# EAGLE design EAGLE_PCB_Design_Project1.3_DavidSalzmann (EAGLE 9.6.2)
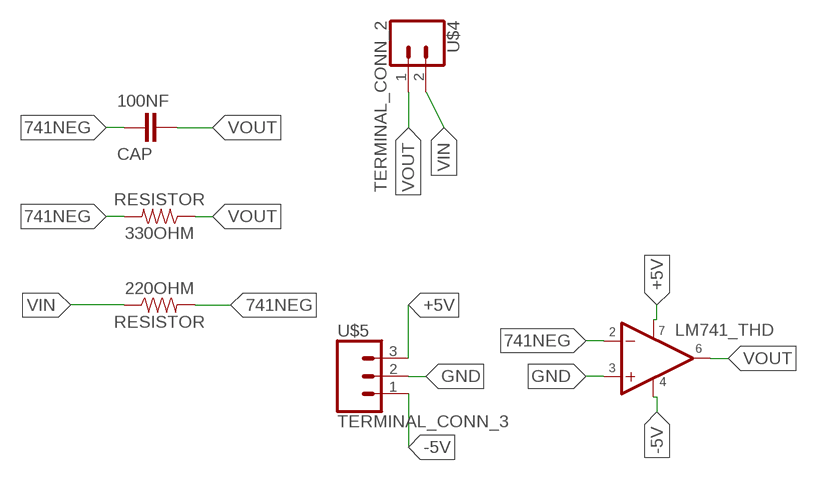
[diagram p0: schematic, sheet 1]

## Parts
100NF  CAP  [CAP-TH]
220OHM  RESISTOR  [RESISTOR]
330OHM  RESISTOR  [RESISTOR]
U$1  IC-LM741  [IC-LM741]
U$4  TERMINAL_CONN_2  [TERMINAL_CONN_2]
U$5  TERMINAL_CONN_3  [TERMINAL-CONN_3]

## Nets
741NEG: 100NF.1 220OHM.2 330OHM.2 U$1.2(-IN)
+5V: U$1.7 U$5.3
-5V: U$1.4 U$5.1
GND: U$1.3(+IN) U$5.2
VIN: 220OHM.1 U$4.2
VOUT: 100NF.2 330OHM.1 U$1.6(OUT) U$4.1

## Library data of the parts
100NF = ECE5_WS:CAP: This is a through hole capacitor for ECE5 worksheet
220OHM 330OHM = ECE5_WS:RESISTOR: This is a resistor
U$1 = ECE5_WS:IC-LM741: This is an IC (Integrated Circuit) LM741 in lab2
U$4 = ECE5_WS:TERMINAL_CONN_2: 2 pin terminal block
U$5 = ECE5_WS:TERMINAL_CONN_3: This is a 3 pin terminal block

## Board
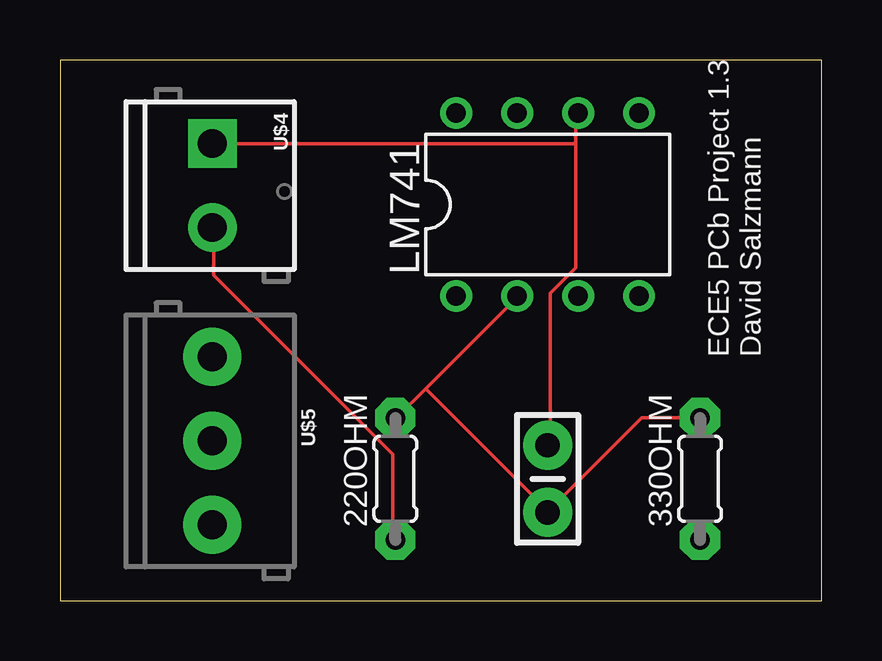
[diagram p1: board, top side]
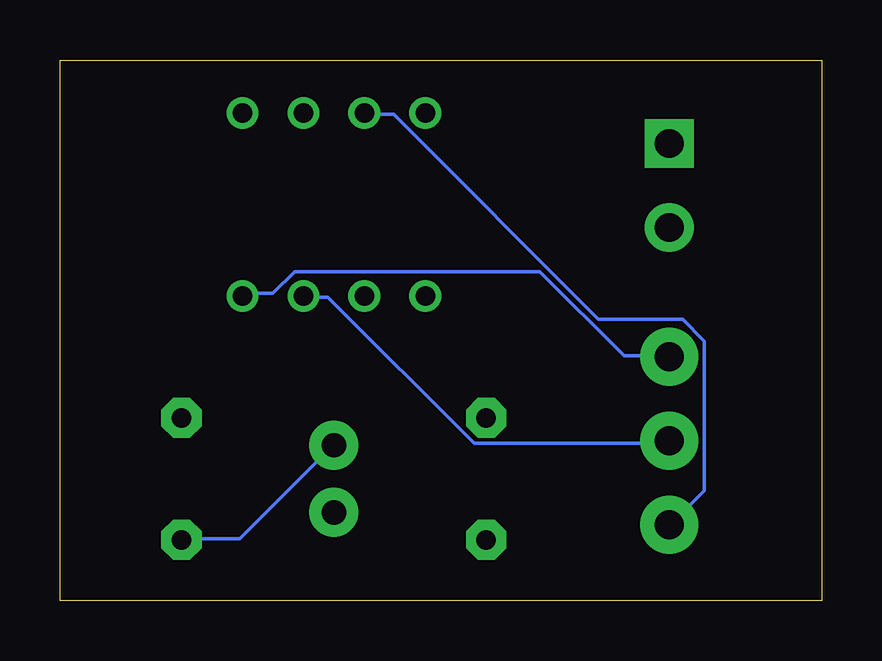
[diagram p2: board, bottom side, seen from below]

Size 31.73 x 22.53 mm. Coordinates in mm from the lower left corner, seen from the top.
Outline: 0,0 31.73,0 31.73,22.53 0,22.53 0,0
Copper layers (1*16): Top 0.035mm / dielectric 1.5mm / Bottom 0.035mm
Design rules "default": minimum track width 6mil, minimum drill 0.35mm, track to track 6mil, track to pad 6mil, pad to pad 6mil, via to via 6mil, smd to smd 6mil, copper to edge 40mil, drill to drill 6mil, minimum pad ring 10mil, minimum via ring 8mil, stop-mask expansion 4mil, vias tented up to drill 0mil, thermal gap 10mil

### Footprints (pad centres in the part's own frame; a part is rotated, then mirrored left to right if it is on the bottom)
CAP-TH = drill 1.016 pad 2.032: 1 -1.397,0; 2 1.397,0
RESISTOR = drill 0.813 pad 1.676 octagon: 1 -2.54,0; 2 2.54,0
IC-LM741 = drill 0.813 pad 1.27: 1 -3.81,-3.81; 2 -1.27,-3.81; 3 1.27,-3.81; 4 3.81,-3.81; 5 3.81,3.81; 6 1.27,3.81; 7 -1.27,3.81; 8 -3.81,3.81
TERMINAL_CONN_2 = drill 1.2 pad 2.032 square: 1 0,0 | drill 1.2 pad 2.032: 2 3.5,0
TERMINAL-CONN_3 = drill 1.2 pad 2.413: 1 0,0; 2 3.5,0; 3 7,0

### Placement (x,y rotation side)
100NF  20.32,5.08 90 top
220OHM  13.97,5.08 90 top
330OHM  26.67,5.08 90 top
U$1  20.32,16.51 0 top
U$4  6.35,19.05 270 top
U$5  6.35,10.16 270 top

### Tracks (layer width: path | path; a pad name or v marks a point on that pad's centre or on a via)
741NEG
  Top 0.152: 15.24,8.84 14.02,7.62 220OHM.2 | 15.24,8.84 19.05,12.65 U$1.2 | 330OHM.2 24.23,7.62 20.42,3.81 100NF.1 20.27,3.81 15.24,8.84
+5V
  Bottom 0.152: U$1.7 19.05,20.27 17.83,20.27 9.3,11.73 5.79,11.73 4.88,10.82 4.88,4.57 6.25,3.2 U$5.3
-5V
  Bottom 0.152: U$1.4 24.08,12.8 22.86,12.8 21.95,13.72 11.73,13.72 8.23,10.21 6.4,10.21 U$5.1
GND
  Bottom 0.152: U$1.3 21.49,12.65 20.57,12.65 14.48,6.55 6.4,6.55 U$5.2
VIN
  Top 0.152: 220OHM.1 13.87,2.59 13.87,6.1 6.4,13.56 6.4,15.54 U$4.2
VOUT
  Top 0.152: 21.49,19.05 21.49,13.87 20.42,12.8 20.42,6.55 100NF.2 | 21.49,19.05 21.49,20.27 U$1.6 | 21.49,19.05 U$4.1
  Bottom 0.152: 330OHM.1 26.67,2.59 24.23,2.59 20.42,6.4 100NF.2

### Text on the board
tPlace: ECE5 PCb Project 1.3 / David Salzmann